# Altium schematic sheet Power.SchDoc: main_assy PCB
size A4
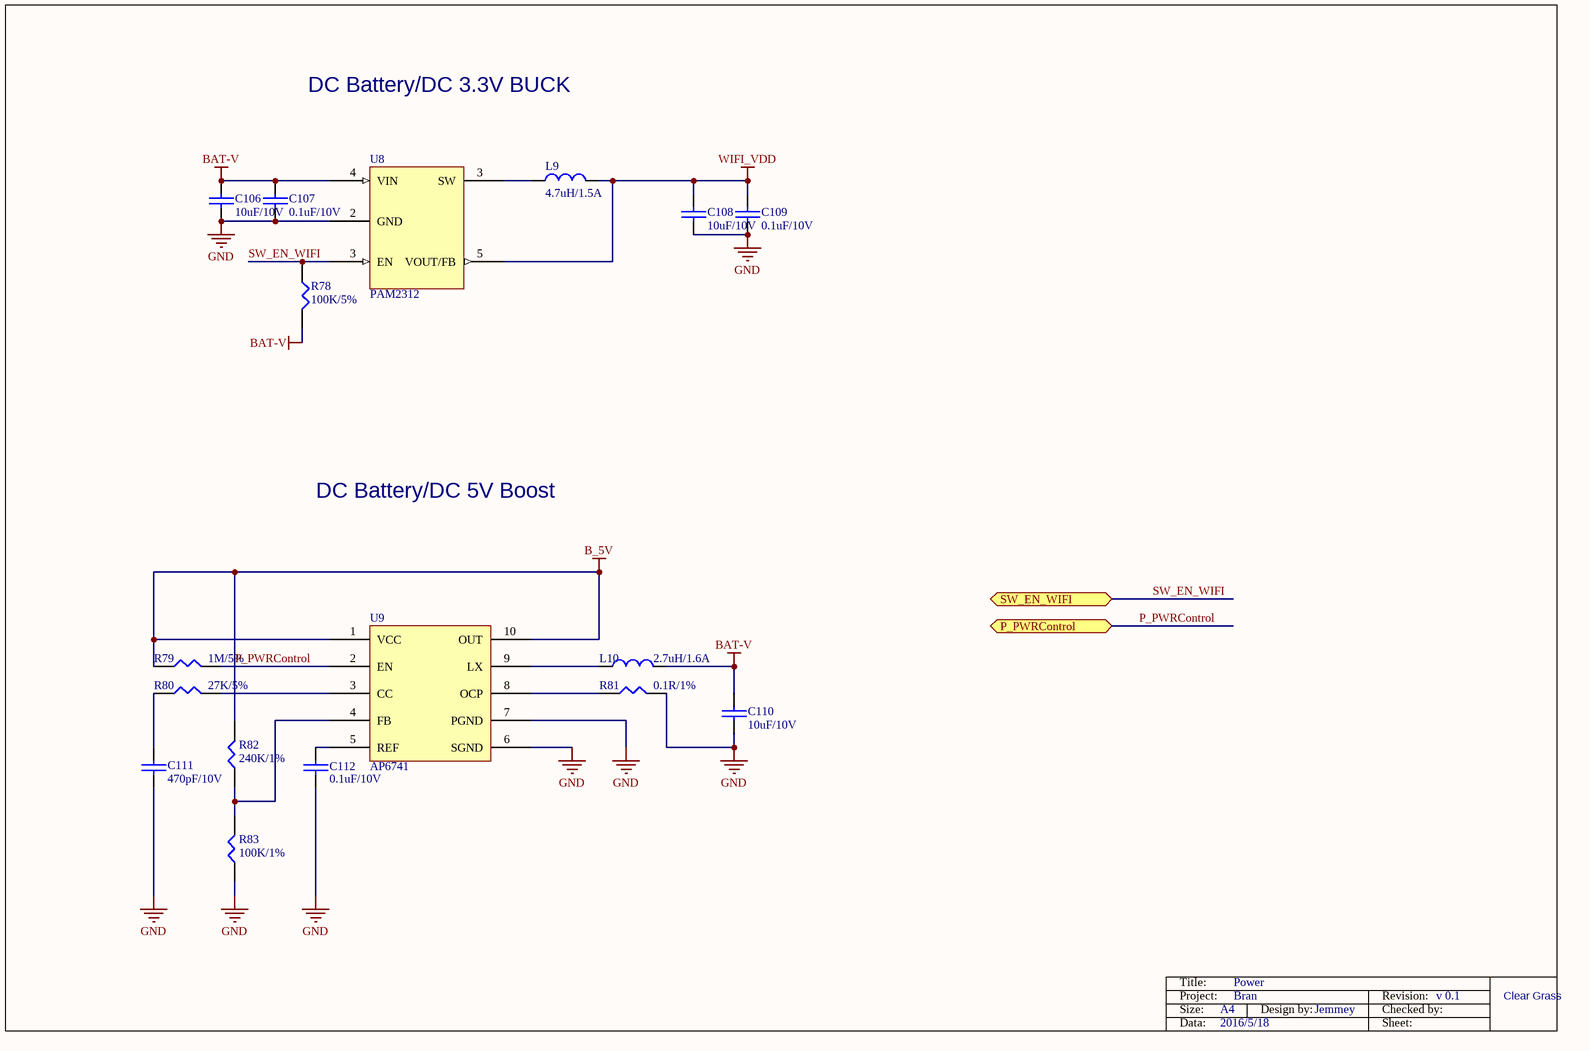
[diagram p0: Power.SchDoc]

## Parts
C106  10uF/10V  [0402C]
C107  0.1uF/10V  [0402C]
C108  10uF/10V  [0402C]
C109  0.1uF/10V  [0402C]
C110  10uF/10V  [0402C]
C111  470pF/10V  [0402C]
C112  0.1uF/10V  [0402C]
L9  4.7uH/1.5A  [Inductance]
L10  2.7uH/1.6A  [Inductance]
R78  100K/5%  [0402R]
R79  1M/5%  [0402R]
R80  27K/5%  [0402R]
R81  0.1R/1%  [1206]
R82  240K/1%  [0402R]
R83  100K/1%  [0402R]
U8  PAM2312  [MOLEX_47590001]
U9  AP6741  [MOLEX_47590001]

## Ports
P_PWRControl (bidir), SW_EN_WIFI (bidir)

## Nets
BAT-V: C106.2 C107.2 C110.2 L10.2 R78.2 U8.4(VIN)
GND: C106.1 C107.1 C108.1 C109.1 C110.1 C111.1 C112.1 R81.2 R83.1 U8.2(GND) U9.6(SGND) U9.7(PGND)
P_PWRControl: R79.1 R79.2 R82.2 U9.1(VCC) U9.2(EN) U9.10(OUT) ; port P_PWRControl  [also labelled B_5V]
WIFI_VDD: C108.2 C109.2 L9.2 U8.5(VOUT/FB)
SW_EN_WIFI: R78.1 U8.3(EN) ; port SW_EN_WIFI
NetC111_2: C111.2 R80.1
NetC112_2: C112.2 U9.5(REF)
NetL9_1: L9.1 U8.3(SW)
NetL10_1: L10.1 U9.9(LX)
NetR80_2: R80.2 U9.3(CC)
NetR81_1: R81.1 U9.8(OCP)
NetR82_1: R82.1 R83.2 U9.4(FB)

## Notes on the sheet
- DC Battery/DC 3.3V BUCK
- DC Battery/DC 5V Boost
- Title:
- Power
- Project:
- Size:
- Data:
- A4
- 2016/5/18
- Bran
- Design by:
- Jemmey
- Revision:
- Sheet:
- Checked by:
- v 0.1
- Clear Grass

## Library data of the parts
C106-C112 = CAP: 厂家：Murata，型号：GRM155R71A104KA01D
L9 L10 = CHOKE
R78-R83 = RES1: 厂家：Yageo，型号：RC0402FR-0710KL
U8 = P: 厂家：Diodes，型号：PAM2312TSOT255330; Manuf_1: MOLEX; Manuf_Part_1: 475900001; Ordered by: Subcon; Silkscreen: USB USER
U9 = PAM: 厂家：Diodes，型号：PAM2401YPADJ; Manuf_1: MOLEX; Manuf_Part_1: 475900001; Ordered by: Subcon; Silkscreen: USB USER